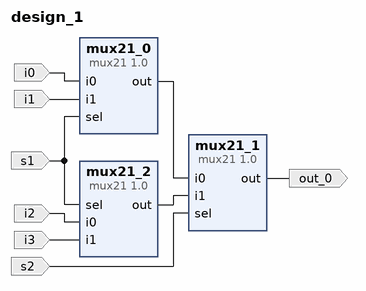
[diagram p0: block diagram of the top level]
# Vivado block design design_1, xc7z020clg484-1, Vivado 2023.2
create_bd_design design_1

create_bd_port -dir I i0
create_bd_port -dir I i1
create_bd_port -dir I s1
create_bd_port -dir I i2
create_bd_port -dir I i3
create_bd_port -dir I s2
create_bd_port -dir O out_0

create_bd_cell -type ip -vlnv ecotec.dc:user:mux21:1.0 mux21_0
create_bd_cell -type ip -vlnv ecotec.dc:user:mux21:1.0 mux21_1
create_bd_cell -type ip -vlnv ecotec.dc:user:mux21:1.0 mux21_2

# ---- connections ----

connect_bd_net -net i0_0_1 [get_bd_ports i0] [get_bd_pins mux21_0/i0]
connect_bd_net -net i0_0_2 [get_bd_ports i2] [get_bd_pins mux21_2/i0]
connect_bd_net -net i1_0_1 [get_bd_ports i1] [get_bd_pins mux21_0/i1]
connect_bd_net -net i1_0_2 [get_bd_ports i3] [get_bd_pins mux21_2/i1]
connect_bd_net [get_bd_pins mux21_0/out] [get_bd_pins mux21_1/i0]
connect_bd_net [get_bd_pins mux21_1/out] [get_bd_ports out_0]
connect_bd_net [get_bd_pins mux21_2/out] [get_bd_pins mux21_1/i1]
connect_bd_net -net sel_0_1 [get_bd_ports s1] [get_bd_pins mux21_0/sel] [get_bd_pins mux21_2/sel]
connect_bd_net -net sel_0_2 [get_bd_ports s2] [get_bd_pins mux21_1/sel]

validate_bd_design
save_bd_design
